# EAGLE design beast (EAGLE 9.6.0)
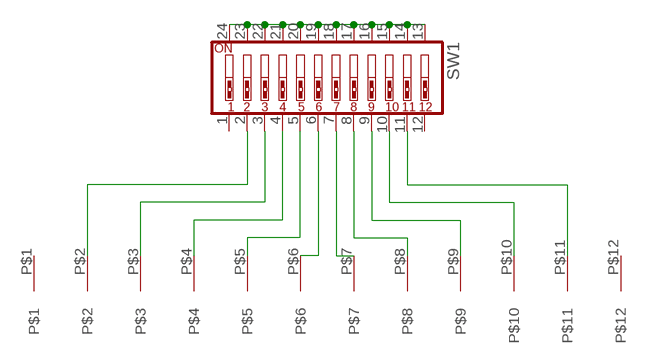
[diagram p0: schematic, sheet 1]

## Parts
SW1  SW_DIP-12  [EDG-12]
U$1  BEAST  [BEAST]

## Nets
N$1: SW1.13 SW1.14 SW1.15 SW1.16 SW1.17 SW1.18 SW1.19 SW1.20 SW1.21 SW1.22 SW1.23 SW1.24
N$2: SW1.2 U$1.P$2
N$3: SW1.3 U$1.P$3
N$5: SW1.10 U$1.P$10
N$6: SW1.5 U$1.P$5
N$7: SW1.6 U$1.P$6
N$8: SW1.7 U$1.P$7
N$9: SW1.8 U$1.P$8
N$10: SW1.9 U$1.P$9
N$11: SW1.11 U$1.P$11
N$13: SW1.4 U$1.P$4
Unconnected: SW1.1 SW1.12 U$1.P$1 U$1.P$12

## Library data of the parts
SW1 = special:SW_DIP-12: DIP SWITCH
U$1 = beastpins:BEAST

## Board
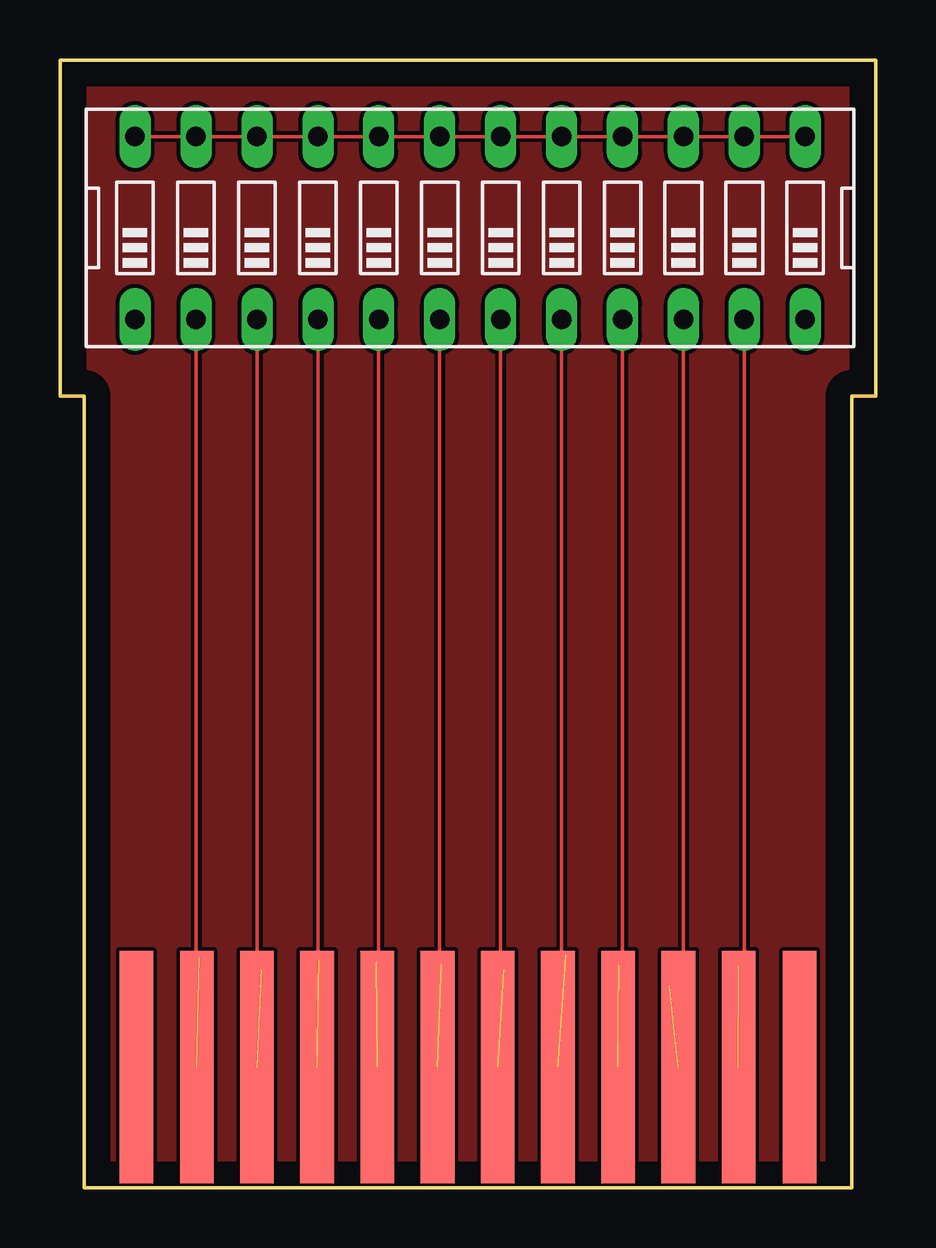
[diagram p1: board, top side]

Size 34 x 47 mm. Coordinates in mm from the lower left corner, seen from the top.
Outline: 2,47 0,47 0,33 1,33 1,0 33,0 33,33 34,33 34,47 1.85,47
Copper layers (1*16): Top 0.035mm / dielectric 1.5mm / Bottom 0.035mm
Design rules "default": minimum track width 6mil, minimum drill 0.35mm, track to track 6mil, track to pad 6mil, pad to pad 6mil, via to via 6mil, smd to smd 6mil, copper to edge 40mil, drill to drill 6mil, minimum pad ring 10mil, minimum via ring 8mil, stop-mask expansion 4mil, vias tented up to drill 0mil, thermal gap 10mil

### Footprints (pad centres in the part's own frame; a part is rotated, then mirrored left to right if it is on the bottom)
EDG-12 = drill 0.813 long: 1 -13.97,-3.81; 2 -11.43,-3.81; 3 -8.89,-3.81; 4 -6.35,-3.81; 5 -3.81,-3.81; 6 -1.27,-3.81; 7 1.27,-3.81; 8 3.81,-3.81; 9 6.35,-3.81; 10 8.89,-3.81; 11 11.43,-3.81; 12 13.97,-3.81; 13 13.97,3.81; 14 11.43,3.81; 15 8.89,3.81; 16 6.35,3.81; 17 3.81,3.81; 18 1.27,3.81; 19 -1.27,3.81; 20 -3.81,3.81; 21 -6.35,3.81; 22 -8.89,3.81; 23 -11.43,3.81; 24 -13.97,3.81
BEAST = smd 1.4 x 9.7: P$1 -27.61,5.02; P$2 -25.1,5.02; P$3 -22.59,5.02; P$4 -20.08,5.02; P$5 -17.57,5.02; P$6 -15.06,5.02; P$7 -12.55,5.02; P$8 -10.04,5.02; P$9 -7.53,5.02; P$10 -5.02,5.02; P$11 -2.51,5.02; P$12 0.03,5.02

### Placement (x,y rotation side)
SW1  17.1,40 0 top
U$1  30.8,0 0 top

### Tracks (layer width: path | path; a pad name or v marks a point on that pad's centre or on a via)
GND
  pour Top: 2,0 2,47 32,47 32,0
  pour Top: 34,33 0,33 0,47 34,47
N$1
  Top 0.152: SW1.24 SW1.23 SW1.22 SW1.21 SW1.20 SW1.19 SW1.18 SW1.17 SW1.16 SW1.15 SW1.13 SW1.14
N$2  (1 unrouted)
  Top 0.152: SW1.2 5.67,9.73 5.8,9.6
N$3  (1 unrouted)
  Top 0.152: SW1.3 8.21,9.29 8.4,9.1
N$5  (1 unrouted)
  Top 0.152: SW1.10 25.99,8.99 25.4,8.4
N$6  (1 unrouted)
  Top 0.152: SW1.5 13.29,9.49 13.2,9.4
N$7  (1 unrouted)
  Top 0.152: 15.9,9.3 15.83,9.37 SW1.6
N$8  (1 unrouted)
  Top 0.152: SW1.7 18.37,9.23 18.5,9.1
N$9  (1 unrouted)
  Top 0.152: SW1.8 20.91,9.89 21.1,9.7
N$10  (1 unrouted)
  Top 0.152: SW1.9 23.45,9.45 23.3,9.3
N$11  (1 unrouted)
  Top 0.152: SW1.11 28.53,9.43 28.3,9.2
N$13  (1 unrouted)
  Top 0.152: SW1.4 10.75,9.55 10.8,9.5